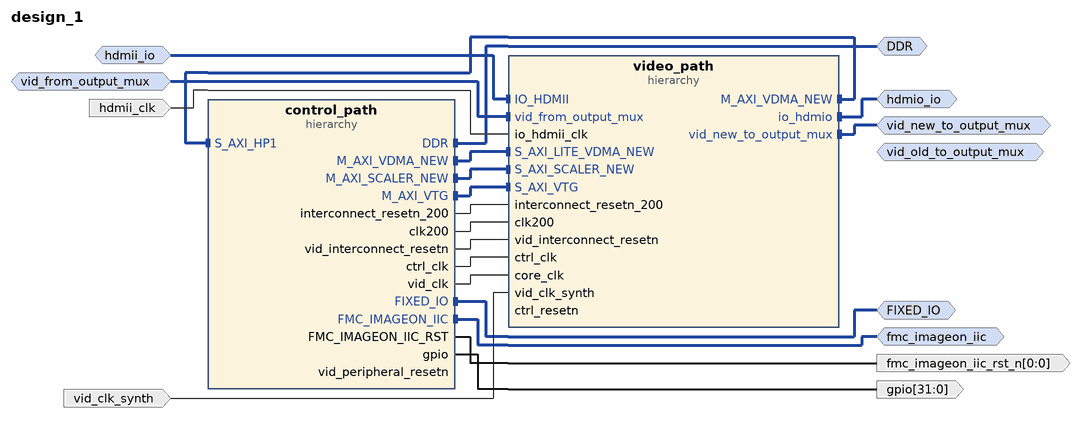
[diagram p0: block diagram of the top level]
# Vivado block design design_1, Vivado 2015.4
create_bd_design design_1

create_bd_intf_port -mode Master -vlnv xilinx.com:interface:ddrx_rtl:1.0 DDR
create_bd_intf_port -mode Master -vlnv xilinx.com:display_processing_system7:fixedio_rtl:1.0 FIXED_IO
create_bd_intf_port -mode Master -vlnv xilinx.com:interface:iic_rtl:1.0 fmc_imageon_iic
create_bd_intf_port -mode Slave -vlnv avnet.com:interface:avnet_hdmi_rtl:1.0 hdmii_io
create_bd_intf_port -mode Master -vlnv avnet.com:interface:avnet_hdmi_rtl:1.0 hdmio_io
create_bd_intf_port -mode Slave -vlnv xilinx.com:interface:vid_io_rtl:1.0 vid_from_output_mux
create_bd_intf_port -mode Master -vlnv xilinx.com:interface:vid_io_rtl:1.0 vid_old_to_output_mux
create_bd_intf_port -mode Master -vlnv xilinx.com:interface:vid_io_rtl:1.0 vid_new_to_output_mux
create_bd_port -dir O -from 0 -to 0 fmc_imageon_iic_rst_n
create_bd_port -dir I -type clk hdmii_clk
create_bd_port -dir O -from 31 -to 0 gpio
create_bd_port -dir I -type clk vid_clk_synth
set_property -dict {CONFIG.FREQ_HZ 145500000 CONFIG.CLK_DOMAIN design_hw_hdmii_clk} [get_bd_ports vid_clk_synth]

create_bd_cell -type hier control_path
create_bd_cell -type hier video_path

# ---- hierarchy /control_path ----
current_bd_instance /control_path
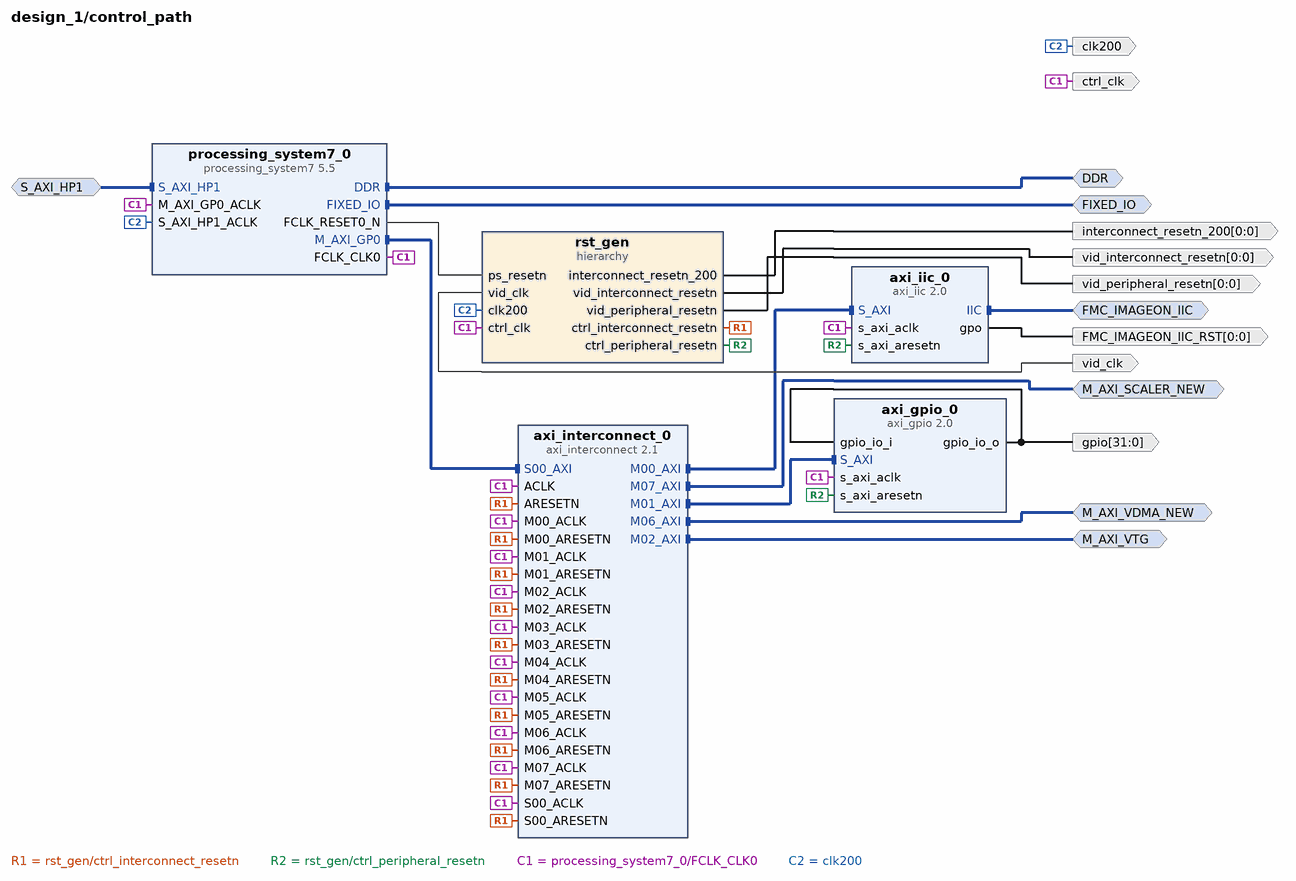
[diagram p1: block diagram inside /control_path]
create_bd_intf_pin -mode Master -vlnv xilinx.com:interface:ddrx_rtl:1.0 DDR
create_bd_intf_pin -mode Master -vlnv xilinx.com:display_processing_system7:fixedio_rtl:1.0 FIXED_IO
create_bd_intf_pin -mode Master -vlnv xilinx.com:interface:iic_rtl:1.0 FMC_IMAGEON_IIC
create_bd_intf_pin -mode Master -vlnv xilinx.com:interface:aximm_rtl:1.0 M_AXI_SCALER_NEW
create_bd_intf_pin -mode Master -vlnv xilinx.com:interface:aximm_rtl:1.0 M_AXI_VDMA_NEW
create_bd_intf_pin -mode Master -vlnv xilinx.com:interface:aximm_rtl:1.0 M_AXI_VTG
create_bd_intf_pin -mode Slave -vlnv xilinx.com:interface:aximm_rtl:1.0 S_AXI_HP1
create_bd_pin -dir O -from 0 -to 0 FMC_IMAGEON_IIC_RST
create_bd_pin -dir O clk200
create_bd_pin -dir O -type clk ctrl_clk
create_bd_pin -dir O -from 31 -to 0 gpio
create_bd_pin -dir O -from 0 -to 0 interconnect_resetn_200
create_bd_pin -dir O -type clk vid_clk
create_bd_pin -dir O -from 0 -to 0 -type rst vid_interconnect_resetn
create_bd_pin -dir O -from 0 -to 0 -type rst vid_peripheral_resetn

create_bd_cell -type ip -vlnv xilinx.com:ip:axi_gpio:2.0 axi_gpio_0
create_bd_cell -type ip -vlnv xilinx.com:ip:axi_iic:2.0 axi_iic_0
create_bd_cell -type ip -vlnv xilinx.com:ip:axi_interconnect:2.1 axi_interconnect_0
set_property -dict {CONFIG.NUM_MI 8} [get_bd_cells axi_interconnect_0]
create_bd_cell -type ip -vlnv xilinx.com:ip:processing_system7:5.5 processing_system7_0
set_property -dict [list \
  CONFIG.PCW_FPGA1_PERIPHERAL_FREQMHZ 155 \
  CONFIG.PCW_FPGA2_PERIPHERAL_FREQMHZ 200 \
  CONFIG.PCW_USE_S_AXI_HP1 1 \
  CONFIG.PCW_QSPI_GRP_SINGLE_SS_ENABLE 1 \
  CONFIG.preset ZC702 \
] [get_bd_cells processing_system7_0]
# 3 more settings of processing_system7_0 are not shown: defaults, MIO pin electricals, DDR timing, and values the tool derives
create_bd_cell -type hier rst_gen

# ---- hierarchy /control_path/rst_gen ----
current_bd_instance /control_path/rst_gen
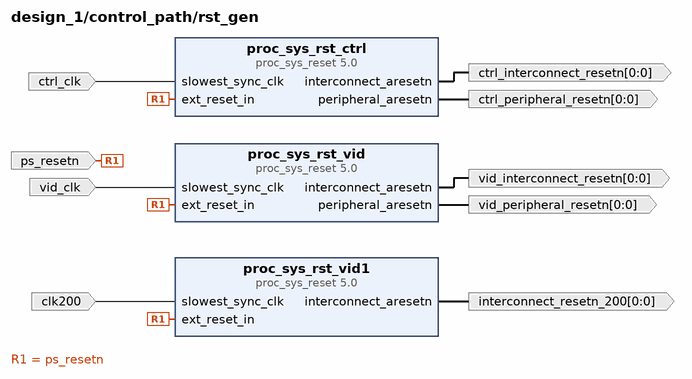
[diagram p2: block diagram inside /control_path/rst_gen]
create_bd_pin -dir I -type clk clk200
create_bd_pin -dir I -type clk ctrl_clk
create_bd_pin -dir O -from 0 -to 0 -type rst ctrl_interconnect_resetn
create_bd_pin -dir O -from 0 -to 0 -type rst ctrl_peripheral_resetn
create_bd_pin -dir O -from 0 -to 0 -type rst interconnect_resetn_200
create_bd_pin -dir I -type rst ps_resetn
create_bd_pin -dir I -type clk vid_clk
create_bd_pin -dir O -from 0 -to 0 -type rst vid_interconnect_resetn
create_bd_pin -dir O -from 0 -to 0 -type rst vid_peripheral_resetn

create_bd_cell -type ip -vlnv xilinx.com:ip:proc_sys_reset:5.0 proc_sys_rst_ctrl
create_bd_cell -type ip -vlnv xilinx.com:ip:proc_sys_reset:5.0 proc_sys_rst_vid
create_bd_cell -type ip -vlnv xilinx.com:ip:proc_sys_reset:5.0 proc_sys_rst_vid1

# ---- hierarchy /video_path ----
current_bd_instance /video_path
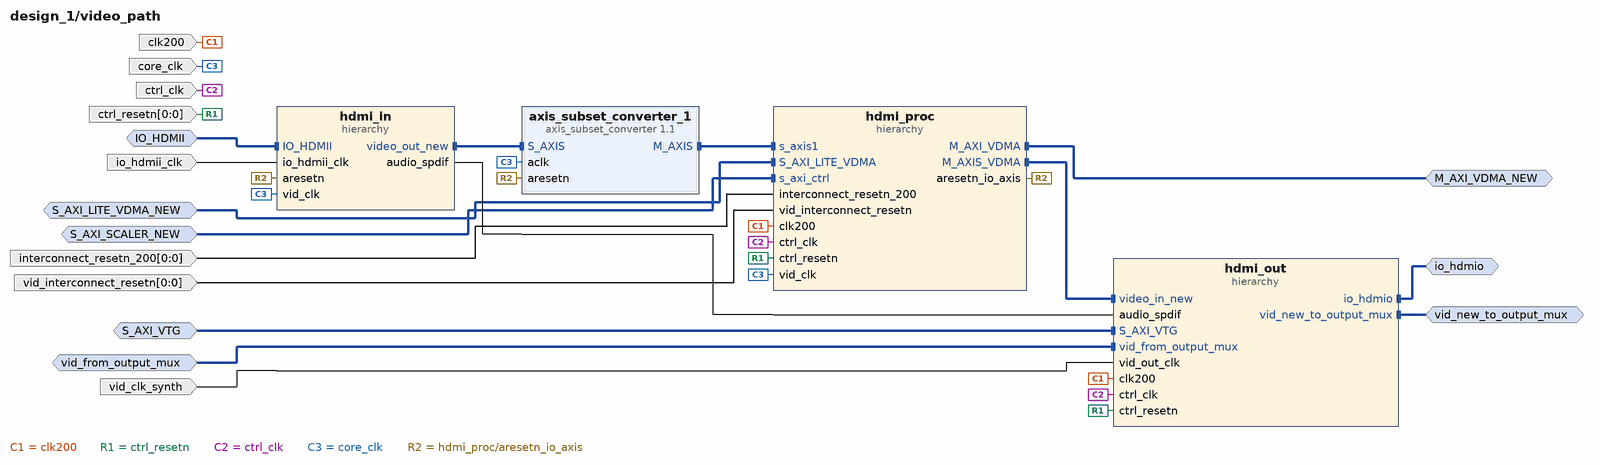
[diagram p3: block diagram inside /video_path]
create_bd_intf_pin -mode Slave -vlnv avnet.com:interface:avnet_hdmi_rtl:1.0 IO_HDMII
create_bd_intf_pin -mode Master -vlnv xilinx.com:interface:aximm_rtl:1.0 M_AXI_VDMA_NEW
create_bd_intf_pin -mode Slave -vlnv xilinx.com:interface:aximm_rtl:1.0 S_AXI_LITE_VDMA_NEW
create_bd_intf_pin -mode Slave -vlnv xilinx.com:interface:aximm_rtl:1.0 S_AXI_SCALER_NEW
create_bd_intf_pin -mode Slave -vlnv xilinx.com:interface:aximm_rtl:1.0 S_AXI_VTG
create_bd_intf_pin -mode Master -vlnv avnet.com:interface:avnet_hdmi_rtl:1.0 io_hdmio
create_bd_intf_pin -mode Slave -vlnv xilinx.com:interface:vid_io_rtl:1.0 vid_from_output_mux
create_bd_intf_pin -mode Master -vlnv xilinx.com:interface:vid_io_rtl:1.0 vid_new_to_output_mux
create_bd_pin -dir I clk200
create_bd_pin -dir I core_clk
create_bd_pin -dir I -type clk ctrl_clk
create_bd_pin -dir I -from 0 -to 0 -type rst ctrl_resetn
create_bd_pin -dir I -from 0 -to 0 interconnect_resetn_200
create_bd_pin -dir I -type clk io_hdmii_clk
create_bd_pin -dir I -type clk vid_clk_synth
create_bd_pin -dir I -from 0 -to 0 -type rst vid_interconnect_resetn

create_bd_cell -type hier hdmi_in
create_bd_cell -type hier hdmi_out
create_bd_cell -type hier hdmi_proc
create_bd_cell -type ip -vlnv xilinx.com:ip:axis_subset_converter:1.1 axis_subset_converter_1
set_property -dict [list \
  CONFIG.S_TDATA_NUM_BYTES 2 \
  CONFIG.M_TDATA_NUM_BYTES 3 \
  CONFIG.TDATA_REMAP {8'b00000000,tdata[15:0]} \
] [get_bd_cells axis_subset_converter_1]

# ---- hierarchy /video_path/hdmi_in ----
current_bd_instance /video_path/hdmi_in
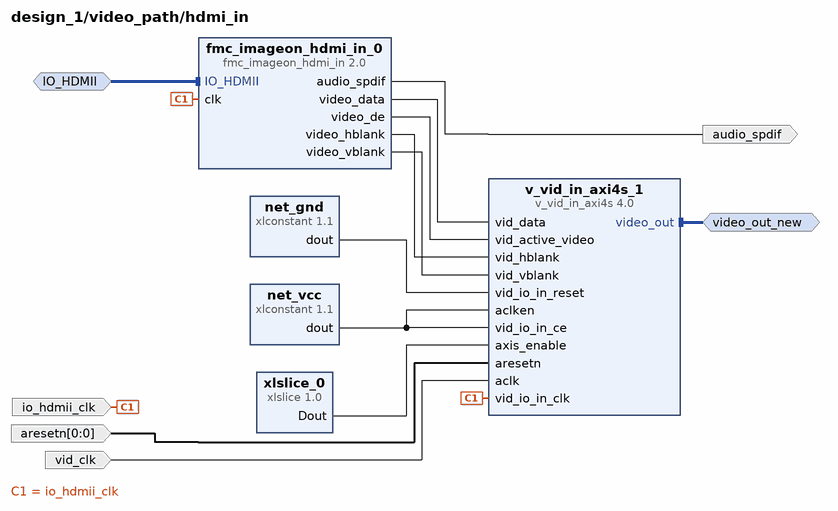
[diagram p4: block diagram inside /video_path/hdmi_in]
create_bd_intf_pin -mode Slave -vlnv avnet.com:interface:avnet_hdmi_rtl:1.0 IO_HDMII
create_bd_intf_pin -mode Master -vlnv xilinx.com:interface:axis_rtl:1.0 video_out_new
create_bd_pin -dir I -from 0 -to 0 -type rst aresetn
create_bd_pin -dir O audio_spdif
create_bd_pin -dir I -type clk io_hdmii_clk
create_bd_pin -dir I -type clk vid_clk

create_bd_cell -type ip -vlnv xilinx.com:ip:xlconstant:1.1 net_gnd
set_property -dict {CONFIG.CONST_VAL 0} [get_bd_cells net_gnd]
create_bd_cell -type ip -vlnv xilinx.com:ip:xlconstant:1.1 net_vcc
create_bd_cell -type ip -vlnv xilinx.com:ip:v_vid_in_axi4s:4.0 v_vid_in_axi4s_1
set_property -dict [list \
  CONFIG.C_M_AXIS_VIDEO_FORMAT 0 \
  CONFIG.C_HAS_ASYNC_CLK 1 \
  CONFIG.C_ADDR_WIDTH 11 \
] [get_bd_cells v_vid_in_axi4s_1]
create_bd_cell -type ip -vlnv xilinx.com:ip:xlslice:1.0 xlslice_0
set_property -dict {CONFIG.DOUT_WIDTH 1 CONFIG.DIN_TO 8 CONFIG.DIN_FROM 8} [get_bd_cells xlslice_0]
create_bd_cell -type ip -vlnv avnet:fmc_imageon:fmc_imageon_hdmi_in:2.0 fmc_imageon_hdmi_in_0

# ---- hierarchy /video_path/hdmi_out ----
current_bd_instance /video_path/hdmi_out
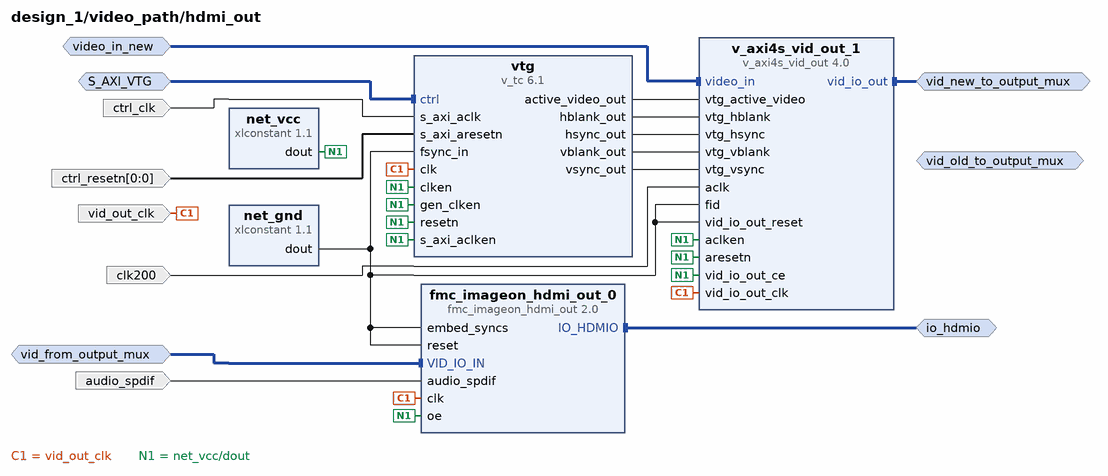
[diagram p5: block diagram inside /video_path/hdmi_out]
create_bd_intf_pin -mode Slave -vlnv xilinx.com:interface:aximm_rtl:1.0 S_AXI_VTG
create_bd_intf_pin -mode Master -vlnv avnet.com:interface:avnet_hdmi_rtl:1.0 io_hdmio
create_bd_intf_pin -mode Slave -vlnv xilinx.com:interface:vid_io_rtl:1.0 vid_from_output_mux
create_bd_intf_pin -mode Master -vlnv xilinx.com:interface:vid_io_rtl:1.0 vid_new_to_output_mux
create_bd_intf_pin -mode Master -vlnv xilinx.com:interface:vid_io_rtl:1.0 vid_old_to_output_mux
create_bd_intf_pin -mode Slave -vlnv xilinx.com:interface:axis_rtl:1.0 video_in_new
create_bd_pin -dir I audio_spdif
create_bd_pin -dir I -type clk clk200
create_bd_pin -dir I -type clk ctrl_clk
create_bd_pin -dir I -from 0 -to 0 -type rst ctrl_resetn
create_bd_pin -dir I -type clk vid_out_clk

create_bd_cell -type ip -vlnv avnet:fmc_imageon:fmc_imageon_hdmi_out:2.0 fmc_imageon_hdmi_out_0
create_bd_cell -type ip -vlnv xilinx.com:ip:xlconstant:1.1 net_gnd
set_property -dict {CONFIG.CONST_VAL 0} [get_bd_cells net_gnd]
create_bd_cell -type ip -vlnv xilinx.com:ip:xlconstant:1.1 net_vcc
create_bd_cell -type ip -vlnv xilinx.com:ip:v_axi4s_vid_out:4.0 v_axi4s_vid_out_1
set_property -dict [list \
  CONFIG.C_S_AXIS_VIDEO_FORMAT 0 \
  CONFIG.C_S_AXIS_VIDEO_DATA_WIDTH 8 \
  CONFIG.C_HAS_ASYNC_CLK 1 \
  CONFIG.C_ADDR_WIDTH 12 \
  CONFIG.C_VTG_MASTER_SLAVE 1 \
] [get_bd_cells v_axi4s_vid_out_1]
create_bd_cell -type ip -vlnv xilinx.com:ip:v_tc:6.1 vtg
set_property -dict {CONFIG.enable_detection false} [get_bd_cells vtg]

# ---- hierarchy /video_path/hdmi_proc ----
current_bd_instance /video_path/hdmi_proc
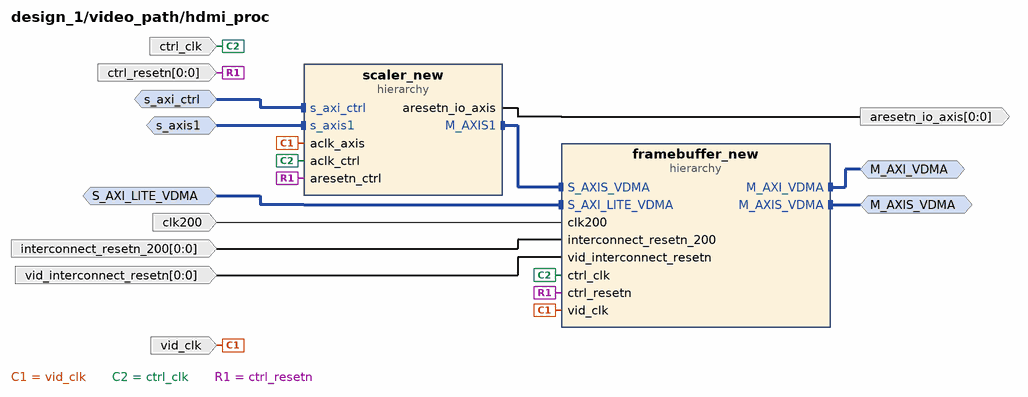
[diagram p6: block diagram inside /video_path/hdmi_proc]
create_bd_intf_pin -mode Slave -vlnv xilinx.com:interface:aximm_rtl:1.0 s_axi_ctrl
create_bd_intf_pin -mode Slave -vlnv xilinx.com:interface:axis_rtl:1.0 s_axis1
create_bd_intf_pin -mode Master -vlnv xilinx.com:interface:axis_rtl:1.0 M_AXIS_VDMA
create_bd_intf_pin -mode Master -vlnv xilinx.com:interface:aximm_rtl:1.0 M_AXI_VDMA
create_bd_intf_pin -mode Slave -vlnv xilinx.com:interface:aximm_rtl:1.0 S_AXI_LITE_VDMA
create_bd_pin -dir I -type clk vid_clk
create_bd_pin -dir I -type clk ctrl_clk
create_bd_pin -dir I -from 0 -to 0 -type rst ctrl_resetn
create_bd_pin -dir O -from 0 -to 0 -type rst aresetn_io_axis
create_bd_pin -dir I -type clk clk200
create_bd_pin -dir I -from 0 -to 0 -type rst interconnect_resetn_200
create_bd_pin -dir I -from 0 -to 0 -type rst vid_interconnect_resetn

create_bd_cell -type hier scaler_new
create_bd_cell -type hier framebuffer_new

# ---- hierarchy /video_path/hdmi_proc/scaler_new ----
current_bd_instance /video_path/hdmi_proc/scaler_new
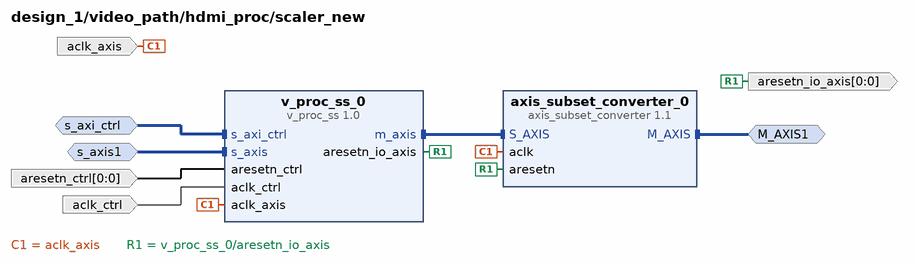
[diagram p7: block diagram inside /video_path/hdmi_proc/scaler_new]
create_bd_intf_pin -mode Master -vlnv xilinx.com:interface:axis_rtl:1.0 M_AXIS1
create_bd_intf_pin -mode Slave -vlnv xilinx.com:interface:aximm_rtl:1.0 s_axi_ctrl
create_bd_intf_pin -mode Slave -vlnv xilinx.com:interface:axis_rtl:1.0 s_axis1
create_bd_pin -dir I -type clk aclk_axis
create_bd_pin -dir I -type clk aclk_ctrl
create_bd_pin -dir I -from 0 -to 0 -type rst aresetn_ctrl
create_bd_pin -dir O -from 0 -to 0 -type rst aresetn_io_axis

create_bd_cell -type ip -vlnv xilinx.com:ip:axis_subset_converter:1.1 axis_subset_converter_0
set_property -dict [list \
  CONFIG.S_TDATA_NUM_BYTES 3 \
  CONFIG.M_TDATA_NUM_BYTES 2 \
  CONFIG.TDATA_REMAP {tdata[15:0]} \
] [get_bd_cells axis_subset_converter_0]
create_bd_cell -type ip -vlnv xilinx.com:ip:v_proc_ss:1.0 v_proc_ss_0
set_property -dict [list \
  CONFIG.C_SAMPLES_PER_CLK 1 \
  CONFIG.C_MAX_DATA_WIDTH 8 \
  CONFIG.C_MAX_COLS 3840 \
  CONFIG.C_MAX_ROWS 2160 \
  CONFIG.C_H_SCALER_TAPS 8 \
  CONFIG.C_V_SCALER_TAPS 8 \
] [get_bd_cells v_proc_ss_0]

# ---- hierarchy /video_path/hdmi_proc/framebuffer_new ----
current_bd_instance /video_path/hdmi_proc/framebuffer_new
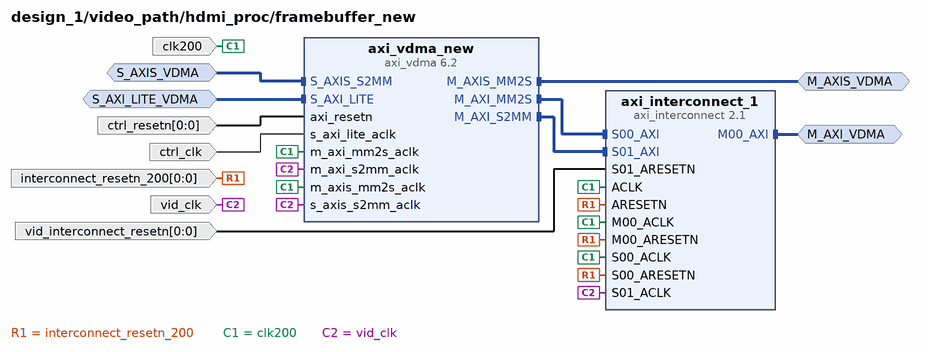
[diagram p8: block diagram inside /video_path/hdmi_proc/framebuffer_new]
create_bd_intf_pin -mode Master -vlnv xilinx.com:interface:axis_rtl:1.0 M_AXIS_VDMA
create_bd_intf_pin -mode Master -vlnv xilinx.com:interface:aximm_rtl:1.0 M_AXI_VDMA
create_bd_intf_pin -mode Slave -vlnv xilinx.com:interface:axis_rtl:1.0 S_AXIS_VDMA
create_bd_intf_pin -mode Slave -vlnv xilinx.com:interface:aximm_rtl:1.0 S_AXI_LITE_VDMA
create_bd_pin -dir I -type clk clk200
create_bd_pin -dir I -type clk ctrl_clk
create_bd_pin -dir I -from 0 -to 0 -type rst ctrl_resetn
create_bd_pin -dir I -from 0 -to 0 -type rst interconnect_resetn_200
create_bd_pin -dir I -type clk vid_clk
create_bd_pin -dir I -from 0 -to 0 -type rst vid_interconnect_resetn

create_bd_cell -type ip -vlnv xilinx.com:ip:axi_interconnect:2.1 axi_interconnect_1
set_property -dict [list \
  CONFIG.NUM_SI 2 \
  CONFIG.NUM_MI 1 \
  CONFIG.STRATEGY 2 \
  CONFIG.M00_HAS_REGSLICE 4 \
  CONFIG.M00_HAS_DATA_FIFO 1 \
  CONFIG.S00_HAS_REGSLICE 4 \
  CONFIG.S01_HAS_REGSLICE 4 \
  CONFIG.S00_HAS_DATA_FIFO 2 \
  CONFIG.S01_HAS_DATA_FIFO 2 \
] [get_bd_cells axi_interconnect_1]
create_bd_cell -type ip -vlnv xilinx.com:ip:axi_vdma:6.2 axi_vdma_new
set_property -dict {CONFIG.c_m_axis_mm2s_tdata_width 16 CONFIG.c_mm2s_linebuffer_depth 512} [get_bd_cells axi_vdma_new]

# ---- connections ----

current_bd_instance /control_path
connect_bd_intf_net [get_bd_intf_pins axi_interconnect_0/S00_AXI] [get_bd_intf_pins processing_system7_0/M_AXI_GP0]
connect_bd_intf_net [get_bd_intf_pins axi_iic_0/S_AXI] [get_bd_intf_pins axi_interconnect_0/M00_AXI]
connect_bd_intf_net [get_bd_intf_pins axi_gpio_0/S_AXI] [get_bd_intf_pins axi_interconnect_0/M01_AXI]
connect_bd_intf_net [get_bd_intf_pins DDR] [get_bd_intf_pins processing_system7_0/DDR]
connect_bd_intf_net [get_bd_intf_pins FIXED_IO] [get_bd_intf_pins processing_system7_0/FIXED_IO]
connect_bd_intf_net [get_bd_intf_pins FMC_IMAGEON_IIC] [get_bd_intf_pins axi_iic_0/IIC]
connect_bd_intf_net [get_bd_intf_pins M_AXI_SCALER_NEW] [get_bd_intf_pins axi_interconnect_0/M07_AXI]
connect_bd_intf_net [get_bd_intf_pins M_AXI_VDMA_NEW] [get_bd_intf_pins axi_interconnect_0/M06_AXI]
connect_bd_intf_net [get_bd_intf_pins M_AXI_VTG] [get_bd_intf_pins axi_interconnect_0/M02_AXI]
connect_bd_intf_net -intf_net S_AXI_HP1_1 [get_bd_intf_pins S_AXI_HP1] [get_bd_intf_pins processing_system7_0/S_AXI_HP1]
connect_bd_net [get_bd_pins axi_gpio_0/gpio_io_o] [get_bd_pins gpio] [get_bd_pins axi_gpio_0/gpio_io_i]
connect_bd_net [get_bd_pins axi_iic_0/gpo] [get_bd_pins FMC_IMAGEON_IIC_RST]
connect_bd_net -net proc_sys_rst_ctrl_interconnect_aresetn [get_bd_pins rst_gen/ctrl_interconnect_resetn] \
  [get_bd_pins axi_interconnect_0/ARESETN] [get_bd_pins axi_interconnect_0/M00_ARESETN] \
  [get_bd_pins axi_interconnect_0/M01_ARESETN] [get_bd_pins axi_interconnect_0/M02_ARESETN] \
  [get_bd_pins axi_interconnect_0/M03_ARESETN] [get_bd_pins axi_interconnect_0/M04_ARESETN] \
  [get_bd_pins axi_interconnect_0/M05_ARESETN] [get_bd_pins axi_interconnect_0/M06_ARESETN] \
  [get_bd_pins axi_interconnect_0/M07_ARESETN] [get_bd_pins axi_interconnect_0/S00_ARESETN]
connect_bd_net -net proc_sys_rst_ctrl_peripheral_aresetn [get_bd_pins rst_gen/ctrl_peripheral_resetn] \
  [get_bd_pins axi_gpio_0/s_axi_aresetn] [get_bd_pins axi_iic_0/s_axi_aresetn]
connect_bd_net -net proc_sys_rst_vid_interconnect_aresetn [get_bd_pins rst_gen/vid_interconnect_resetn] [get_bd_pins vid_interconnect_resetn]
connect_bd_net -net proc_sys_rst_vid_peripheral_aresetn [get_bd_pins rst_gen/vid_peripheral_resetn] [get_bd_pins vid_peripheral_resetn]
connect_bd_net [get_bd_pins processing_system7_0/FCLK_CLK0] \
  [get_bd_pins ctrl_clk] [get_bd_pins axi_gpio_0/s_axi_aclk] [get_bd_pins axi_iic_0/s_axi_aclk] \
  [get_bd_pins processing_system7_0/M_AXI_GP0_ACLK] [get_bd_pins axi_interconnect_0/ACLK] \
  [get_bd_pins axi_interconnect_0/M00_ACLK] [get_bd_pins axi_interconnect_0/M01_ACLK] \
  [get_bd_pins axi_interconnect_0/M02_ACLK] [get_bd_pins axi_interconnect_0/M03_ACLK] \
  [get_bd_pins axi_interconnect_0/M04_ACLK] [get_bd_pins axi_interconnect_0/M05_ACLK] \
  [get_bd_pins axi_interconnect_0/M06_ACLK] [get_bd_pins axi_interconnect_0/M07_ACLK] \
  [get_bd_pins axi_interconnect_0/S00_ACLK] [get_bd_pins rst_gen/ctrl_clk]
connect_bd_net -net processing_system7_0_FCLK_CLK1 [get_bd_pins vid_clk] [get_bd_pins rst_gen/vid_clk]
connect_bd_net -net processing_system7_0_FCLK_CLK2 [get_bd_pins clk200] [get_bd_pins processing_system7_0/S_AXI_HP1_ACLK] [get_bd_pins rst_gen/clk200]
connect_bd_net [get_bd_pins processing_system7_0/FCLK_RESET0_N] [get_bd_pins rst_gen/ps_resetn]
connect_bd_net -net rst_gen_interconnect_aresetn [get_bd_pins rst_gen/interconnect_resetn_200] [get_bd_pins interconnect_resetn_200]

current_bd_instance /control_path/rst_gen
connect_bd_net [get_bd_pins proc_sys_rst_ctrl/interconnect_aresetn] [get_bd_pins ctrl_interconnect_resetn]
connect_bd_net [get_bd_pins proc_sys_rst_ctrl/peripheral_aresetn] [get_bd_pins ctrl_peripheral_resetn]
connect_bd_net [get_bd_pins proc_sys_rst_vid1/interconnect_aresetn] [get_bd_pins interconnect_resetn_200]
connect_bd_net [get_bd_pins proc_sys_rst_vid/interconnect_aresetn] [get_bd_pins vid_interconnect_resetn]
connect_bd_net [get_bd_pins proc_sys_rst_vid/peripheral_aresetn] [get_bd_pins vid_peripheral_resetn]
connect_bd_net -net processing_system7_0_FCLK_CLK0 [get_bd_pins ctrl_clk] [get_bd_pins proc_sys_rst_ctrl/slowest_sync_clk]
connect_bd_net -net processing_system7_0_FCLK_CLK1 [get_bd_pins vid_clk] [get_bd_pins proc_sys_rst_vid/slowest_sync_clk]
connect_bd_net -net processing_system7_0_FCLK_RESET0_N [get_bd_pins ps_resetn] \
  [get_bd_pins proc_sys_rst_ctrl/ext_reset_in] [get_bd_pins proc_sys_rst_vid/ext_reset_in] \
  [get_bd_pins proc_sys_rst_vid1/ext_reset_in]
connect_bd_net -net slowest_sync_clk_1 [get_bd_pins clk200] [get_bd_pins proc_sys_rst_vid1/slowest_sync_clk]

current_bd_instance /video_path
connect_bd_intf_net -intf_net framebuffer_new_M_AXIS_VDMA [get_bd_intf_pins hdmi_proc/M_AXIS_VDMA] [get_bd_intf_pins hdmi_out/video_in_new]
connect_bd_intf_net [get_bd_intf_pins axis_subset_converter_1/M_AXIS] [get_bd_intf_pins hdmi_proc/s_axis1]
connect_bd_intf_net [get_bd_intf_pins hdmi_in/video_out_new] [get_bd_intf_pins axis_subset_converter_1/S_AXIS]
connect_bd_intf_net [get_bd_intf_pins IO_HDMII] [get_bd_intf_pins hdmi_in/IO_HDMII]
connect_bd_intf_net -intf_net framebuffer_new_M_AXI_VDMA [get_bd_intf_pins M_AXI_VDMA_NEW] [get_bd_intf_pins hdmi_proc/M_AXI_VDMA]
connect_bd_intf_net -intf_net S_AXI_LITE_VDMA1_1 [get_bd_intf_pins S_AXI_LITE_VDMA_NEW] [get_bd_intf_pins hdmi_proc/S_AXI_LITE_VDMA]
connect_bd_intf_net [get_bd_intf_pins S_AXI_SCALER_NEW] [get_bd_intf_pins hdmi_proc/s_axi_ctrl]
connect_bd_intf_net -intf_net control_path_M_AXI_VTG [get_bd_intf_pins S_AXI_VTG] [get_bd_intf_pins hdmi_out/S_AXI_VTG]
connect_bd_intf_net [get_bd_intf_pins io_hdmio] [get_bd_intf_pins hdmi_out/io_hdmio]
connect_bd_intf_net [get_bd_intf_pins vid_from_output_mux] [get_bd_intf_pins hdmi_out/vid_from_output_mux]
connect_bd_intf_net [get_bd_intf_pins vid_new_to_output_mux] [get_bd_intf_pins hdmi_out/vid_new_to_output_mux]
connect_bd_net -net ARESETN_1 [get_bd_pins interconnect_resetn_200] [get_bd_pins hdmi_proc/interconnect_resetn_200]
connect_bd_net -net clk_1 [get_bd_pins io_hdmii_clk] [get_bd_pins hdmi_in/io_hdmii_clk]
connect_bd_net [get_bd_pins hdmi_in/audio_spdif] [get_bd_pins hdmi_out/audio_spdif]
connect_bd_net -net m_axi_mm2s_aclk_1 [get_bd_pins clk200] [get_bd_pins hdmi_out/clk200] [get_bd_pins hdmi_proc/clk200]
connect_bd_net -net proc_sys_rst_ctrl_peripheral_aresetn [get_bd_pins ctrl_resetn] \
  [get_bd_pins hdmi_out/ctrl_resetn] [get_bd_pins hdmi_proc/ctrl_resetn]
connect_bd_net -net proc_sys_rst_vid_interconnect_aresetn [get_bd_pins vid_interconnect_resetn] [get_bd_pins hdmi_proc/vid_interconnect_resetn]
connect_bd_net -net processing_system7_0_FCLK_CLK0 [get_bd_pins ctrl_clk] [get_bd_pins hdmi_out/ctrl_clk] [get_bd_pins hdmi_proc/ctrl_clk]
connect_bd_net -net processing_system7_0_FCLK_CLK1 [get_bd_pins core_clk] \
  [get_bd_pins hdmi_in/vid_clk] [get_bd_pins hdmi_proc/vid_clk] [get_bd_pins axis_subset_converter_1/aclk]
connect_bd_net -net v_proc_ss_0_aresetn_io_axis [get_bd_pins hdmi_proc/aresetn_io_axis] \
  [get_bd_pins hdmi_in/aresetn] [get_bd_pins axis_subset_converter_1/aresetn]
connect_bd_net -net vid_out_clk_1 [get_bd_pins vid_clk_synth] [get_bd_pins hdmi_out/vid_out_clk]

current_bd_instance /video_path/hdmi_in
connect_bd_intf_net [get_bd_intf_pins IO_HDMII] [get_bd_intf_pins fmc_imageon_hdmi_in_0/IO_HDMII]
connect_bd_intf_net [get_bd_intf_pins video_out_new] [get_bd_intf_pins v_vid_in_axi4s_1/video_out]
connect_bd_net [get_bd_pins aresetn] [get_bd_pins v_vid_in_axi4s_1/aresetn]
connect_bd_net [get_bd_pins fmc_imageon_hdmi_in_0/video_data] [get_bd_pins v_vid_in_axi4s_1/vid_data]
connect_bd_net [get_bd_pins fmc_imageon_hdmi_in_0/video_de] [get_bd_pins v_vid_in_axi4s_1/vid_active_video]
connect_bd_net [get_bd_pins fmc_imageon_hdmi_in_0/video_hblank] [get_bd_pins v_vid_in_axi4s_1/vid_hblank]
connect_bd_net [get_bd_pins fmc_imageon_hdmi_in_0/video_vblank] [get_bd_pins v_vid_in_axi4s_1/vid_vblank]
connect_bd_net [get_bd_pins net_gnd/dout] [get_bd_pins v_vid_in_axi4s_1/vid_io_in_reset]
connect_bd_net [get_bd_pins net_vcc/dout] [get_bd_pins v_vid_in_axi4s_1/aclken] [get_bd_pins v_vid_in_axi4s_1/vid_io_in_ce]
connect_bd_net -net processing_system7_0_FCLK_CLK1 [get_bd_pins vid_clk] [get_bd_pins v_vid_in_axi4s_1/aclk]
connect_bd_net [get_bd_pins xlslice_0/Dout] [get_bd_pins v_vid_in_axi4s_1/axis_enable]
connect_bd_net [get_bd_pins fmc_imageon_hdmi_in_0/audio_spdif] [get_bd_pins audio_spdif]
connect_bd_net -net clk_1 [get_bd_pins io_hdmii_clk] [get_bd_pins v_vid_in_axi4s_1/vid_io_in_clk] [get_bd_pins fmc_imageon_hdmi_in_0/clk]

current_bd_instance /video_path/hdmi_out
connect_bd_intf_net [get_bd_intf_pins S_AXI_VTG] [get_bd_intf_pins vtg/ctrl]
connect_bd_intf_net [get_bd_intf_pins io_hdmio] [get_bd_intf_pins fmc_imageon_hdmi_out_0/IO_HDMIO]
connect_bd_intf_net [get_bd_intf_pins vid_from_output_mux] [get_bd_intf_pins fmc_imageon_hdmi_out_0/VID_IO_IN]
connect_bd_intf_net [get_bd_intf_pins vid_new_to_output_mux] [get_bd_intf_pins v_axi4s_vid_out_1/vid_io_out]
connect_bd_intf_net [get_bd_intf_pins video_in_new] [get_bd_intf_pins v_axi4s_vid_out_1/video_in]
connect_bd_net -net aclk_1 [get_bd_pins clk200] [get_bd_pins v_axi4s_vid_out_1/aclk]
connect_bd_net [get_bd_pins audio_spdif] [get_bd_pins fmc_imageon_hdmi_out_0/audio_spdif]
connect_bd_net -net clk_1 [get_bd_pins vid_out_clk] \
  [get_bd_pins fmc_imageon_hdmi_out_0/clk] [get_bd_pins v_axi4s_vid_out_1/vid_io_out_clk] [get_bd_pins vtg/clk]
connect_bd_net [get_bd_pins net_vcc/dout] \
  [get_bd_pins fmc_imageon_hdmi_out_0/oe] [get_bd_pins v_axi4s_vid_out_1/aclken] [get_bd_pins v_axi4s_vid_out_1/aresetn] \
  [get_bd_pins v_axi4s_vid_out_1/vid_io_out_ce] [get_bd_pins vtg/clken] [get_bd_pins vtg/gen_clken] [get_bd_pins vtg/resetn] \
  [get_bd_pins vtg/s_axi_aclken]
connect_bd_net -net s_axi_aclk_1 [get_bd_pins ctrl_clk] [get_bd_pins vtg/s_axi_aclk]
connect_bd_net -net s_axi_aresetn_1 [get_bd_pins ctrl_resetn] [get_bd_pins vtg/s_axi_aresetn]
connect_bd_net -net vid_io_out_reset_1 [get_bd_pins net_gnd/dout] \
  [get_bd_pins fmc_imageon_hdmi_out_0/embed_syncs] [get_bd_pins fmc_imageon_hdmi_out_0/reset] \
  [get_bd_pins v_axi4s_vid_out_1/fid] [get_bd_pins v_axi4s_vid_out_1/vid_io_out_reset] [get_bd_pins vtg/fsync_in]
connect_bd_net [get_bd_pins vtg/active_video_out] [get_bd_pins v_axi4s_vid_out_1/vtg_active_video]
connect_bd_net [get_bd_pins vtg/hblank_out] [get_bd_pins v_axi4s_vid_out_1/vtg_hblank]
connect_bd_net [get_bd_pins vtg/hsync_out] [get_bd_pins v_axi4s_vid_out_1/vtg_hsync]
connect_bd_net [get_bd_pins vtg/vblank_out] [get_bd_pins v_axi4s_vid_out_1/vtg_vblank]
connect_bd_net [get_bd_pins vtg/vsync_out] [get_bd_pins v_axi4s_vid_out_1/vtg_vsync]

current_bd_instance /video_path/hdmi_proc
connect_bd_intf_net -intf_net axis_subset_converter_0_M_AXIS [get_bd_intf_pins framebuffer_new/S_AXIS_VDMA] [get_bd_intf_pins scaler_new/M_AXIS1]
connect_bd_intf_net [get_bd_intf_pins s_axi_ctrl] [get_bd_intf_pins scaler_new/s_axi_ctrl]
connect_bd_intf_net -intf_net v_tpg_0_m_axis_video [get_bd_intf_pins s_axis1] [get_bd_intf_pins scaler_new/s_axis1]
connect_bd_intf_net [get_bd_intf_pins M_AXIS_VDMA] [get_bd_intf_pins framebuffer_new/M_AXIS_VDMA]
connect_bd_intf_net [get_bd_intf_pins M_AXI_VDMA] [get_bd_intf_pins framebuffer_new/M_AXI_VDMA]
connect_bd_intf_net -intf_net S_AXI_LITE_VDMA1_1 [get_bd_intf_pins S_AXI_LITE_VDMA] [get_bd_intf_pins framebuffer_new/S_AXI_LITE_VDMA]
connect_bd_net -net processing_system7_0_FCLK_CLK1 [get_bd_pins vid_clk] [get_bd_pins framebuffer_new/vid_clk] [get_bd_pins scaler_new/aclk_axis]
connect_bd_net -net processing_system7_0_FCLK_CLK0 [get_bd_pins ctrl_clk] [get_bd_pins framebuffer_new/ctrl_clk] [get_bd_pins scaler_new/aclk_ctrl]
connect_bd_net -net proc_sys_rst_ctrl_peripheral_aresetn [get_bd_pins ctrl_resetn] \
  [get_bd_pins framebuffer_new/ctrl_resetn] [get_bd_pins scaler_new/aresetn_ctrl]
connect_bd_net -net v_proc_ss_0_aresetn_io_axis [get_bd_pins scaler_new/aresetn_io_axis] [get_bd_pins aresetn_io_axis]
connect_bd_net -net m_axi_mm2s_aclk_1 [get_bd_pins clk200] [get_bd_pins framebuffer_new/clk200]
connect_bd_net -net ARESETN_1 [get_bd_pins interconnect_resetn_200] [get_bd_pins framebuffer_new/interconnect_resetn_200]
connect_bd_net -net proc_sys_rst_vid_interconnect_aresetn [get_bd_pins vid_interconnect_resetn] [get_bd_pins framebuffer_new/vid_interconnect_resetn]

current_bd_instance /video_path/hdmi_proc/scaler_new
connect_bd_intf_net [get_bd_intf_pins axis_subset_converter_0/S_AXIS] [get_bd_intf_pins v_proc_ss_0/m_axis]
connect_bd_intf_net [get_bd_intf_pins M_AXIS1] [get_bd_intf_pins axis_subset_converter_0/M_AXIS]
connect_bd_intf_net [get_bd_intf_pins s_axi_ctrl] [get_bd_intf_pins v_proc_ss_0/s_axi_ctrl]
connect_bd_intf_net -intf_net v_tpg_0_m_axis_video [get_bd_intf_pins s_axis1] [get_bd_intf_pins v_proc_ss_0/s_axis]
connect_bd_net -net proc_sys_rst_ctrl_peripheral_aresetn [get_bd_pins aresetn_ctrl] [get_bd_pins v_proc_ss_0/aresetn_ctrl]
connect_bd_net -net processing_system7_0_FCLK_CLK0 [get_bd_pins aclk_ctrl] [get_bd_pins v_proc_ss_0/aclk_ctrl]
connect_bd_net -net processing_system7_0_FCLK_CLK1 [get_bd_pins aclk_axis] \
  [get_bd_pins axis_subset_converter_0/aclk] [get_bd_pins v_proc_ss_0/aclk_axis]
connect_bd_net [get_bd_pins v_proc_ss_0/aresetn_io_axis] [get_bd_pins aresetn_io_axis] [get_bd_pins axis_subset_converter_0/aresetn]

current_bd_instance /video_path/hdmi_proc/framebuffer_new
connect_bd_intf_net [get_bd_intf_pins axi_interconnect_1/S00_AXI] [get_bd_intf_pins axi_vdma_new/M_AXI_MM2S]
connect_bd_intf_net [get_bd_intf_pins axi_interconnect_1/S01_AXI] [get_bd_intf_pins axi_vdma_new/M_AXI_S2MM]
connect_bd_intf_net -intf_net axi_vdma_0_M_AXIS_MM2S [get_bd_intf_pins M_AXIS_VDMA] [get_bd_intf_pins axi_vdma_new/M_AXIS_MM2S]
connect_bd_intf_net [get_bd_intf_pins M_AXI_VDMA] [get_bd_intf_pins axi_interconnect_1/M00_AXI]
connect_bd_intf_net -intf_net v_scaler_0_video_out [get_bd_intf_pins S_AXIS_VDMA] [get_bd_intf_pins axi_vdma_new/S_AXIS_S2MM]
connect_bd_intf_net -intf_net axi_interconnect_0_M03_AXI [get_bd_intf_pins S_AXI_LITE_VDMA] [get_bd_intf_pins axi_vdma_new/S_AXI_LITE]
connect_bd_net -net ARESETN_1 [get_bd_pins interconnect_resetn_200] \
  [get_bd_pins axi_interconnect_1/ARESETN] [get_bd_pins axi_interconnect_1/M00_ARESETN] \
  [get_bd_pins axi_interconnect_1/S00_ARESETN]
connect_bd_net -net m_axi_mm2s_aclk_1 [get_bd_pins clk200] \
  [get_bd_pins axi_vdma_new/m_axi_mm2s_aclk] [get_bd_pins axi_vdma_new/m_axis_mm2s_aclk] \
  [get_bd_pins axi_interconnect_1/ACLK] [get_bd_pins axi_interconnect_1/M00_ACLK] [get_bd_pins axi_interconnect_1/S00_ACLK]
connect_bd_net -net proc_sys_rst_ctrl_peripheral_aresetn [get_bd_pins ctrl_resetn] [get_bd_pins axi_vdma_new/axi_resetn]
connect_bd_net -net processing_system7_0_FCLK_CLK0 [get_bd_pins ctrl_clk] [get_bd_pins axi_vdma_new/s_axi_lite_aclk]
connect_bd_net -net processing_system7_0_FCLK_CLK1 [get_bd_pins vid_clk] \
  [get_bd_pins axi_vdma_new/m_axi_s2mm_aclk] [get_bd_pins axi_vdma_new/s_axis_s2mm_aclk] \
  [get_bd_pins axi_interconnect_1/S01_ACLK]
connect_bd_net [get_bd_pins vid_interconnect_resetn] [get_bd_pins axi_interconnect_1/S01_ARESETN]

current_bd_instance /
connect_bd_intf_net -intf_net S_AXI_HP1_1 [get_bd_intf_pins control_path/S_AXI_HP1] [get_bd_intf_pins video_path/M_AXI_VDMA_NEW]
connect_bd_intf_net -intf_net control_path_M06_AXI [get_bd_intf_pins control_path/M_AXI_VDMA_NEW] [get_bd_intf_pins video_path/S_AXI_LITE_VDMA_NEW]
connect_bd_intf_net [get_bd_intf_pins control_path/M_AXI_SCALER_NEW] [get_bd_intf_pins video_path/S_AXI_SCALER_NEW]
connect_bd_intf_net [get_bd_intf_pins control_path/M_AXI_VTG] [get_bd_intf_pins video_path/S_AXI_VTG]
connect_bd_intf_net -intf_net processing_system7_0_DDR [get_bd_intf_ports DDR] [get_bd_intf_pins control_path/DDR]
connect_bd_intf_net -intf_net processing_system7_0_FIXED_IO [get_bd_intf_ports FIXED_IO] [get_bd_intf_pins control_path/FIXED_IO]
connect_bd_intf_net -intf_net axi_iic_0_IIC [get_bd_intf_ports fmc_imageon_iic] [get_bd_intf_pins control_path/FMC_IMAGEON_IIC]
connect_bd_intf_net [get_bd_intf_ports hdmii_io] [get_bd_intf_pins video_path/IO_HDMII]
connect_bd_intf_net -intf_net hdmi_out_IO_HDMIO [get_bd_intf_ports hdmio_io] [get_bd_intf_pins video_path/io_hdmio]
connect_bd_intf_net -intf_net VID_IO_IN_1 [get_bd_intf_ports vid_from_output_mux] [get_bd_intf_pins video_path/vid_from_output_mux]
connect_bd_intf_net -intf_net video_path_vid_io_out [get_bd_intf_ports vid_new_to_output_mux] [get_bd_intf_pins video_path/vid_new_to_output_mux]
connect_bd_net -net axi_iic_0_gpo [get_bd_pins control_path/FMC_IMAGEON_IIC_RST] [get_bd_ports fmc_imageon_iic_rst_n]
connect_bd_net -net clk_1 [get_bd_ports hdmii_clk] [get_bd_pins video_path/io_hdmii_clk]
connect_bd_net -net control_path_gpio_io_o [get_bd_pins control_path/gpio] [get_bd_ports gpio]
connect_bd_net -net control_path_interconnect_aresetn [get_bd_pins control_path/interconnect_resetn_200] \
  [get_bd_pins video_path/interconnect_resetn_200]
connect_bd_net -net m_axi_mm2s_aclk_1 [get_bd_pins control_path/clk200] [get_bd_pins video_path/clk200]
# net proc_sys_rst_ctrl_peripheral_aresetn has one end: video_path/ctrl_resetn
connect_bd_net -net proc_sys_rst_vid_interconnect_aresetn [get_bd_pins control_path/vid_interconnect_resetn] \
  [get_bd_pins video_path/vid_interconnect_resetn]
# net proc_sys_rst_vid_peripheral_aresetn has one end: control_path/vid_peripheral_resetn
connect_bd_net -net processing_system7_0_FCLK_CLK0 [get_bd_pins control_path/ctrl_clk] [get_bd_pins video_path/ctrl_clk]
connect_bd_net -net processing_system7_0_FCLK_CLK1 [get_bd_pins control_path/vid_clk] [get_bd_pins video_path/core_clk]
connect_bd_net -net vid_out_clk_1 [get_bd_ports vid_clk_synth] [get_bd_pins video_path/vid_clk_synth]

# ---- address map ----
assign_bd_address -offset 0x41200000 -range 64K -target_address_space [get_bd_addr_spaces control_path/processing_system7_0/Data] [get_bd_addr_segs control_path/axi_gpio_0/S_AXI/Reg]
assign_bd_address -offset 0x41600000 -range 64K -target_address_space [get_bd_addr_spaces control_path/processing_system7_0/Data] [get_bd_addr_segs control_path/axi_iic_0/S_AXI/Reg]
assign_bd_address -offset 0x43000000 -range 64K -target_address_space [get_bd_addr_spaces control_path/processing_system7_0/Data] [get_bd_addr_segs video_path/hdmi_proc/framebuffer_new/axi_vdma_new/S_AXI_LITE/Reg]
assign_bd_address -offset 0x43C00000 -range 256K -target_address_space [get_bd_addr_spaces control_path/processing_system7_0/Data] [get_bd_addr_segs video_path/hdmi_proc/scaler_new/v_proc_ss_0/s_axi_ctrl/Reg]
assign_bd_address -offset 0x43C50000 -range 64K -target_address_space [get_bd_addr_spaces control_path/processing_system7_0/Data] [get_bd_addr_segs video_path/hdmi_out/vtg/ctrl/Reg]
assign_bd_address -offset 0x00000000 -range 1G -target_address_space [get_bd_addr_spaces video_path/hdmi_proc/framebuffer_new/axi_vdma_new/Data_MM2S] [get_bd_addr_segs control_path/processing_system7_0/S_AXI_HP1/HP1_DDR_LOWOCM]
assign_bd_address -offset 0x00000000 -range 1G -target_address_space [get_bd_addr_spaces video_path/hdmi_proc/framebuffer_new/axi_vdma_new/Data_S2MM] [get_bd_addr_segs control_path/processing_system7_0/S_AXI_HP1/HP1_DDR_LOWOCM]

validate_bd_design
save_bd_design
